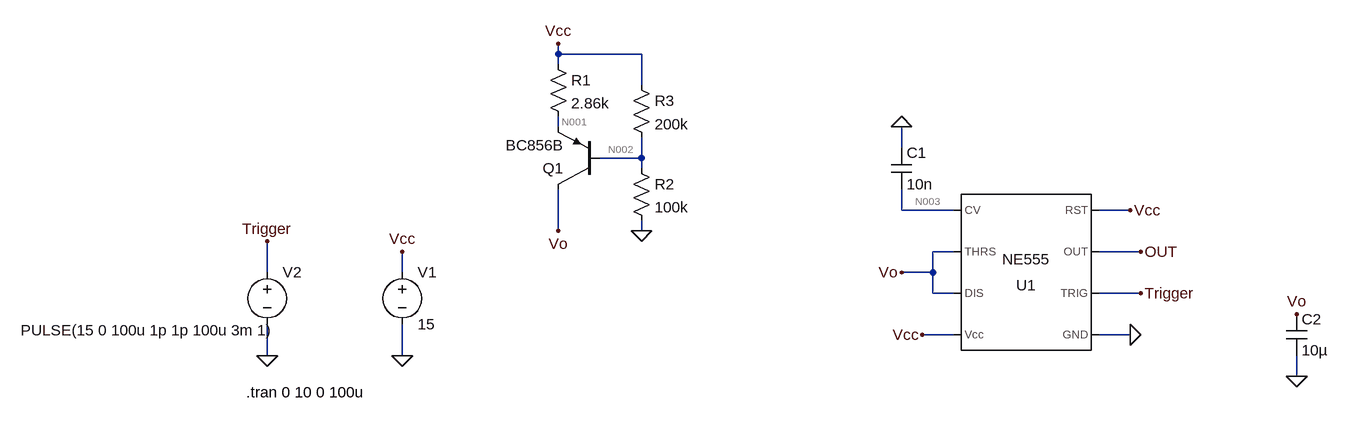
[diagram p0: schematic triang_555.asc]
triang_555.asc, the LTspice schematic file:
Version 4
SHEET 1 1048 680
WIRE -160 -192 -160 -208
WIRE -32 -192 -160 -192
WIRE -160 -176 -160 -192
WIRE -32 -144 -32 -192
WIRE -160 -80 -160 -96
WIRE 368 -48 368 -80
WIRE -32 -32 -32 -64
WIRE -32 -32 -96 -32
WIRE -32 -16 -32 -32
WIRE 368 48 368 16
WIRE 448 48 368 48
WIRE 720 48 672 48
WIRE -160 80 -160 16
WIRE -32 80 -32 64
WIRE 448 112 416 112
WIRE 736 112 672 112
WIRE -608 144 -608 96
WIRE -400 144 -400 112
WIRE 416 144 416 112
WIRE 416 144 368 144
WIRE 416 176 416 144
WIRE 448 176 416 176
WIRE 736 176 672 176
WIRE 448 240 400 240
WIRE 720 240 672 240
WIRE -608 272 -608 224
WIRE -400 272 -400 224
WIRE 976 304 976 272
FLAG -400 112 Vcc
FLAG -400 272 0
FLAG 400 240 Vcc
FLAG 720 48 Vcc
FLAG 720 240 0
FLAG -32 80 0
FLAG 368 -80 0
FLAG 368 144 Vo
FLAG 976 208 Vo
FLAG 976 304 0
FLAG 736 176 Trigger
FLAG 736 112 OUT
FLAG -608 272 0
FLAG -608 96 Trigger
FLAG -160 -208 Vcc
FLAG -160 80 Vo
SYMBOL Misc\\NE555 560 144 R180
SYMATTR InstName U1
SYMBOL voltage -400 128 R0
WINDOW 123 0 0 Left 0
WINDOW 39 0 0 Left 0
SYMATTR InstName V1
SYMATTR Value 15
SYMBOL pnp -96 16 R180
SYMATTR InstName Q1
SYMATTR Value BC856B
SYMBOL res -176 -192 R0
SYMATTR InstName R1
SYMATTR Value 2.86k
SYMBOL cap 352 -48 R0
SYMATTR InstName C1
SYMATTR Value 10n
SYMBOL cap 960 208 R0
SYMATTR InstName C2
SYMATTR Value 10µ
SYMBOL voltage -608 128 R0
WINDOW 3 -379 105 Left 2
WINDOW 123 0 0 Left 0
WINDOW 39 0 0 Left 0
SYMATTR Value PULSE(15 0 100u 1p 1p 100u 3m 1)
SYMATTR InstName V2
SYMBOL res -48 -32 R0
SYMATTR InstName R2
SYMATTR Value 100k
SYMBOL res -48 -160 R0
SYMATTR InstName R3
SYMATTR Value 200k
TEXT -640 328 Left 2 !.tran 0 10 0 100u

The netlist it stands for:
* triang_555.asc
XU1 0 Trigger OUT Vcc N003 Vo Vo Vcc NE555  ; pins GND TRIG OUT RST CV THRS DIS Vcc
V1 Vcc 0 15
Q1 Vo N002 N001 0 BC856B
R1 Vcc N001 2.86k
C1 0 N003 10n
C2 Vo 0 10µ
V2 Trigger 0 PULSE(15 0 100u 1p 1p 100u 3m 1)
R2 N002 0 100k
R3 Vcc N002 200k
.model NPN NPN
.model PNP PNP
.lib standard.bjt
.tran 0 10 0 100u
.lib NE555.sub
.backanno
.end

* Results of the author's LTspice run, read from the files saved beside the schematic
* Operating Point, zero values left out:
*   V(trigger) = 15 V
*   V(n003) = 10 V
*   V(vcc) = 15 V
*   V(vo) = 14.61 V
*   V(out) = 15 V
*   V(n002) = 13.98 V
*   V(n001) = 14.61 V
*   Ic(Q1) = -34.1 nA
*   Ib(Q1) = -134.6 µA
*   Ie(Q1) = 134.7 µA
*   I(R3) = 5.111 µA
*   I(R2) = 139.8 µA
*   I(R1) = 134.7 µA
*   I(V2) = -15 nA
*   I(V1) = -4.994 mA
*   Ix(u1:1) = -4.854 mA
*   Ix(u1:2) = 15 nA
*   Ix(u1:4) = 89.33 µA
*   Ix(u1:6) = 14.61 nA
*   Ix(u1:7) = 19.49 nA
*   Ix(u1:8) = 4.765 mA
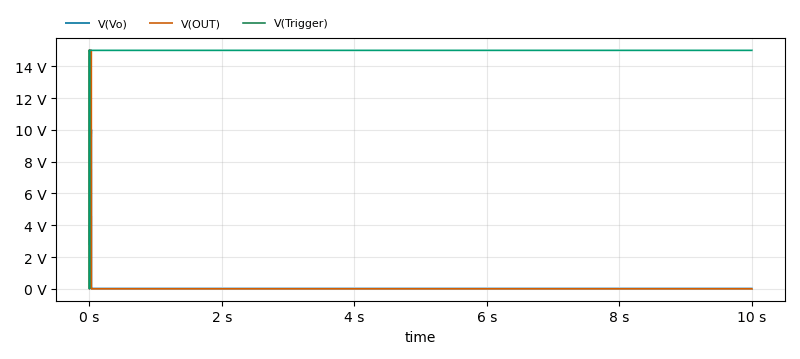
[diagram p1: Transient Analysis of triang_555.asc, plotted from the saved traces]
* Transient Analysis, 1 run:
*   V(Vo): min 18.19 mV, max 14.61 V, average 37.18 mV, rms 379.2 mV, last 18.19 mV
*   V(OUT): min 90 µV, max 15 V, average 42.29 mV, rms 795.6 mV, last 90 µV
*   V(Trigger): min 0 V, max 15 V, average 15 V, rms 15 V, last 15 V